# Altium project 课题设计步进电机.PrjPCB
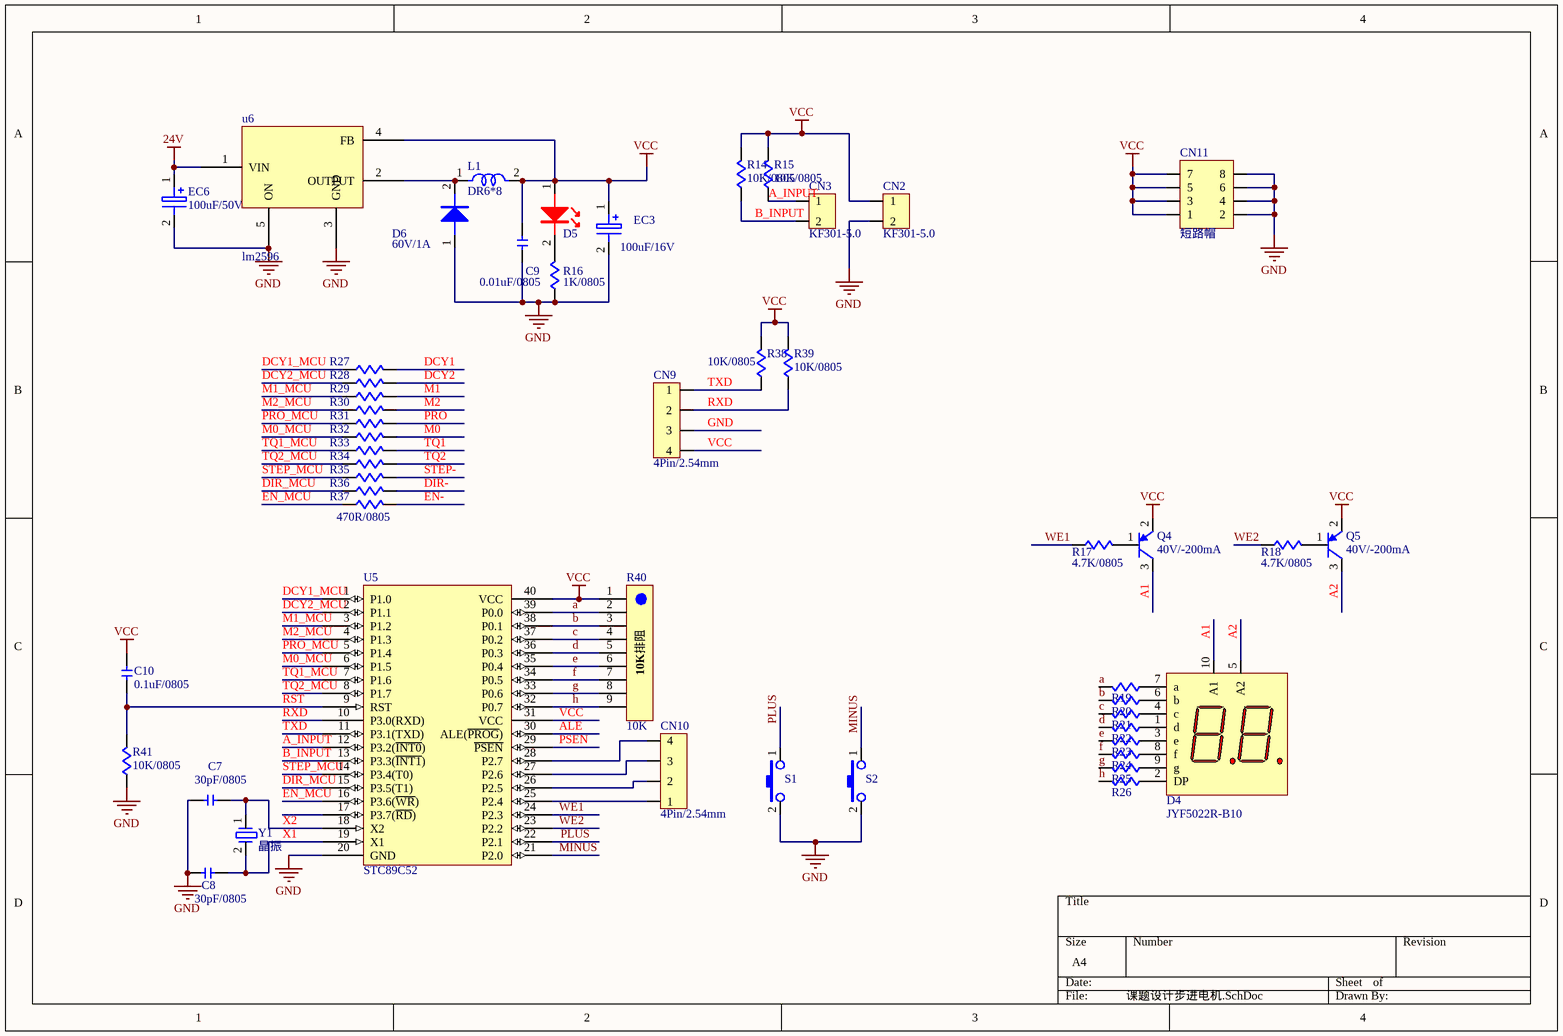
[diagram p0: 课题设计步进电机.SchDoc]
2 sheets, 84 parts. Net scope: global (net labels, ports and power ports of the same name join across sheets).
Board file: 电机驱动课程设计.PcbDoc
Sheets:
  课题设计步进电机.SchDoc
  电机驱动.SchDoc

## Sheet 课题设计步进电机.SchDoc
size A4

### Parts
C7  30pF/0805  [WSC0805]
C8  30pF/0805  [WSC0805]
C9  0.01uF/0805  [WSC0805]
C10  0.1uF/0805  [WSC0805]
CN2  KF301-5.0  [KF301-5.0]
CN3  KF301-5.0  [KF301-5.0]
CN9  4Pin/2.54mm  [THT-CON4-2.54-2.54A/S-H8.5]
CN10  4Pin/2.54mm  [THT-CON4-2.54-2.54A/S-H8.5]
CN11  短路帽  [THT-CON2*4-2.54-5.08A/D]
D4  JYF5022R-B10  [LED10-2.54*15.24-19A/S-AA]
D5  LED0805  [SD0805]  (value not drawn)
D6  60V/1A  [SDO-214AC(SMA)]
EC3  100uF/16V  [CAPC2-5-5*11A/D]
EC6  100uF/50V  [CAPC2-3.5-8*11.5A/S]
L1  DR6*8  [L2-3-8*11A/S]
Q4  40V/-200mA  [WSOT-23]
Q5  40V/-200mA  [WSOT-23]
R14  10K/0805  [WSR0805]
R15  10K/0805  [WSR0805]
R16  1K/0805  [WSR0805]
R17  4.7K/0805  [WSR0805]
R18  4.7K/0805  [WSR0805]
R19  470R/0805  [WSR0805]  (value not drawn)
R20  470R/0805  [WSR0805]  (value not drawn)
R21  470R/0805  [WSR0805]  (value not drawn)
R22  470R/0805  [WSR0805]  (value not drawn)
R23  470R/0805  [WSR0805]  (value not drawn)
R24  470R/0805  [WSR0805]  (value not drawn)
R25  470R/0805  [WSR0805]  (value not drawn)
R26  470R/0805  [WSR0805]  (value not drawn)
R27  470R/0805  [WSR0805]  (value not drawn)
R28  470R/0805  [WSR0805]  (value not drawn)
R29  470R/0805  [WSR0805]  (value not drawn)
R30  470R/0805  [WSR0805]  (value not drawn)
R31  470R/0805  [WSR0805]  (value not drawn)
R32  470R/0805  [WSR0805]
R33  470R/0805  [WSR0805]  (value not drawn)
R34  470R/0805  [WSR0805]  (value not drawn)
R35  470R/0805  [WSR0805]  (value not drawn)
R36  470R/0805  [WSR0805]  (value not drawn)
R37  470R/0805  [WSR0805]  (value not drawn)
R38  10K/0805  [WSR0805]
R39  10K/0805  [WSR0805]
R40  10K  [R_9*2.54]
R41  10K/0805  [WSR0805]
S1  12VDC/30mA  [THT-SW4-6.5*4.5A/D]  (value not drawn)
S2  12VDC/30mA  [THT-SW4-6.5*4.5A/D]  (value not drawn)
U5  STC89C52  [DIP-40]
u6  lm2596  [TO-220-5L]
Y1  晶振  [HC-49]

### Nets
24V: EC6.1 u6.1(VIN)
GND: C7.1 C8.1 C9.1 CN2.2 CN9.3 CN11.2 CN11.4 CN11.6 CN11.8 D6.1(A) EC3.2 EC6.2 R16.1 R41.1 S1.2 S2.2 U5.20(GND) u6.3(GND) u6.5(ON)
VCC: C9.2 C10.2 CN2.1 CN9.4 CN11.1 CN11.3 CN11.5 CN11.7 D5.1(A) EC3.1 L1.2 Q4.2(E) Q5.2(E) R14.2 R15.2 R38.2 R39.2 R40.1(COM) U5.31(VCC) U5.40(VCC) u6.4(FB)
a: R19.2 R40.2 U5.39(P0.0)
A1: D4.10(A1) Q4.3(C)
A2: D4.5(A2) Q5.3(C)
A_INPUT: CN3.1 R15.1 U5.12(P3.2(~{INT0}))
ALE: U5.30(ALE(~{PROG}))
b: R20.2 R40.3 U5.38(P0.1)
B_INPUT: CN3.2 R14.1 U5.13(P3.3(~{INT1}))
c: R21.2 R40.4 U5.37(P0.2)
d: R22.2 R40.5 U5.36(P0.3)
DCY1: R27.2
DCY1_MCU: R27.1 U5.1(P1.0)
DCY2: R28.2
DCY2_MCU: R28.1 U5.2(P1.1)
DIR-: R36.2
DIR_MCU: R36.1 U5.15(P3.5(T1))
e: R23.2 R40.6 U5.35(P0.4)
EN-: R37.2
EN_MCU: R37.1 U5.16(P3.6(~{WR}))
f: R24.2 R40.7 U5.34(P0.5)
g: R25.2 R40.8 U5.33(P0.6)
h: R26.2 R40.9 U5.32(P0.7)
M0: R32.2
M0_MCU: R32.1 U5.6(P1.5)
M1: R29.2
M1_MCU: R29.1 U5.3(P1.2)
M2: R30.2
M2_MCU: R30.1 U5.4(P1.3)
MINUS: S2.1 U5.21(P2.0)
PLUS: S1.1 U5.22(P2.1)
PRO: R31.2
PRO_MCU: R31.1 U5.5(P1.4)
PSEN: U5.29(~{PSEN})
RST: C10.1 R41.2 U5.9(RST)
RXD: CN9.2 R39.1 U5.10(P3.0(RXD))
STEP-: R35.2
STEP_MCU: R35.1 U5.14(P3.4(T0))
TQ1: R33.2
TQ1_MCU: R33.1 U5.7(P1.6)
TQ2: R34.2
TQ2_MCU: R34.1 U5.8(P1.7)
TXD: CN9.1 R38.1 U5.11(P3.1(TXD))
WE1: R17.1 U5.24(P2.3)
WE2: R18.1 U5.23(P2.2)
X1: C8.2 U5.19(X1) Y1.2
X2: C7.2 U5.18(X2) Y1.1
NetCN10_1: CN10.1 U5.25(P2.4)
NetCN10_2: CN10.2 U5.26(P2.5)
NetCN10_3: CN10.3 U5.27(P2.6)
NetCN10_4: CN10.4 U5.28(P2.7)
NetD4_1: D4.1(d) R22.1
NetD4_2: D4.2(DP) R26.1
NetD4_3: D4.3(e) R23.1
NetD4_4: D4.4(c) R21.1
NetD4_6: D4.6(b) R20.1
NetD4_7: D4.7(a) R19.1
NetD4_8: D4.8(f) R24.1
NetD4_9: D4.9(g) R25.1
NetD5_2: D5.2(K) R16.2
NetD6_2: D6.2(K) L1.1 u6.2(OUTPUT)
NetQ4_1: Q4.1(B) R17.2
NetQ5_1: Q5.1(B) R18.2

Not connected (* = marked no-connect by the designer): U5 17(P3.7(~{RD}))

### Notes on the sheet
- (in symbol 插件排阻) 10K排阻

### Library data of the parts
C7 C8 = R21080010: R21080010/工业C/消费C/贴片电容/30pF±5%/50V/NPO/0805; 装配类型: SMD; 物料编码: R21080010; 物料描述: 贴片电容/30pF±5%/50V/NPO/0805; 优选等级: 工业C/消费C
C9 = R21050097: R21050097/工业C/消费C/贴片电容/0.01uF±5%/50V/NPO/0805; 装配类型: SMD; 物料编码: R21050097; 物料描述: 贴片电容/0.01uF±5%/50V/NPO/0805; 优选等级: 工业C/消费C
C10 = R21050005: R21050005/工业B/消费B/贴片电容/0.1uF±10%/50V/X7R/0805; 装配类型: SMD; 物料编码: R21050005; 物料描述: 贴片电容/0.1uF±10%/50V/X7R/0805; 优选等级: 工业B/消费B
CN9 CN10 = R30041122: R30041122/消费B/普通插座/单排排母/4PIN/3A/单排/直脚/鱼叉母座/2.54mm/-40~105℃/H=8.5mm; 优选等级: 消费B; 装配类型: THT; 物料描述: 普通插座/单排排母/4PIN/3A/单排/直脚/鱼叉母座/2.54mm/-40~105℃/H=8.5mm; 物料编码: R30041122
CN11 = 2*54Pin/2.54mm
D4 = R26010188: R26010188/消费C/数码管/2位/共阳/红色630nm/40mcd/25*19*8mm/无铅; 优选等级: 消费C; 装配类型: THT; 物料描述: 数码管/2位/共阳/红色630nm/40mcd/25*19*8mm/无铅; 物料编码: R26010188
D5 = R26010108: R26010108/工业A/消费A/发光二极管/红色/61mcd@20mA/0805SMD/LED0805; 装配类型: SMD; 物料描述: 发光二极管/红色/61mcd@20mA/0805SMD; 物料编码: R26010108; 优选等级: 工业A/消费A
D6 = R26030097: R26030097/工业C/肖特基二极管/60V/1A/0.70V/SMA/B160; 优选等级: 工业C; 装配类型: SMD; 物料描述: 肖特基二极管/60V/1A/0.70V/SMA; 物料编码: R26030097
EC3 = R21010764: R21010764/消费C/铝电解电容/105℃/100uF/16V/φ5*11; 优选等级: 消费C; 装配类型: THT; 物料编码: R21010764; 物料描述: 铝电解电容/105℃/100uF/16V/φ5*11
EC6 = R21010695: R21010695/消费C/电解电容/105℃/100uF/50v/φ8*11.5/引脚间距3.5mm; 优选等级: 消费C; 装配类型: THT; 物料编码: R21010695; 物料描述: 电解电容/105℃/100uF/50v/φ8*11.5/引脚间距3.5mm
L1 = R22011019: R22011019/消费A/工字型电感DR6*8/100uH/MC1600-L3; 优选等级: 消费A; 装配类型: THT; 物料编码: R22011019; 物料描述: 工字型电感DR6*8/100uH/MC1600-L3
Q4 Q5 = R26080002: R26080002/工业A/消费A/小信号三极管/PNP/-40V/-200mA/SOT-23; 装配类型: SMD; 物料编码: R26080002; 物料描述: 小信号三极管/PNP/-40V/-200mA/SOT-23; 优选等级: 工业A/消费A
R14 R15 R38 R39 R41 = R20180048: R20180048/工业A/消费A/贴片电阻/1/8W/10KΩ±5%/0805; 装配类型: SMD; 物料编码: R20180048; 物料描述: 贴片电阻/1/8W/10KΩ±5%/0805; 优选等级: 工业A/消费A
R16 = R20180023: R20180023/工业A/消费A/贴片电阻/1/8W/1KΩ±5%/0805; 装配类型: SMD; 物料编码: R20180023; 物料描述: 贴片电阻/1/8W/1KΩ±5%/0805; 优选等级: 工业A/消费A
R17 R18 = R20180039: R20180039/工业A/消费A/贴片电阻/1/8W/4.7KΩ±5%/0805; 装配类型: SMD; 物料编码: R20180039; 物料描述: 贴片电阻/1/8W/4.7KΩ±5%/0805; 优选等级: 工业A/消费A
R19-R26 = R20180017: R20180017/工业A/消费A/贴片电阻/1/8W/470Ω±5%/0805; 装配类型: SMD; 物料编码: R20180017; 物料描述: 贴片电阻/1/8W/470Ω±5%/0805; 优选等级: 工业A/消费A
R27-R37 = R20180245: R20180245/工业C/消费C/贴片电阻/1/8W/470Ω±1%/0805/ROHS; 装配类型: SMD; 物料编码: R20180245; 物料描述: 贴片电阻/1/8W/470Ω±1%/0805/ROHS; 优选等级: 工业C/消费C
R40 = 插件排阻
S1 S2 = R34010007: R34010007/消费A/微动开关/12VDC/30mA/6*6*4.3mm/插件; 优选等级: 消费A; 装配类型: THT; 物料编码: R34010007; 物料描述: 微动开关/12VDC/30mA/6*6*4.3mm/插件
U5 = AT89C51

## Sheet 电机驱动.SchDoc
size A4
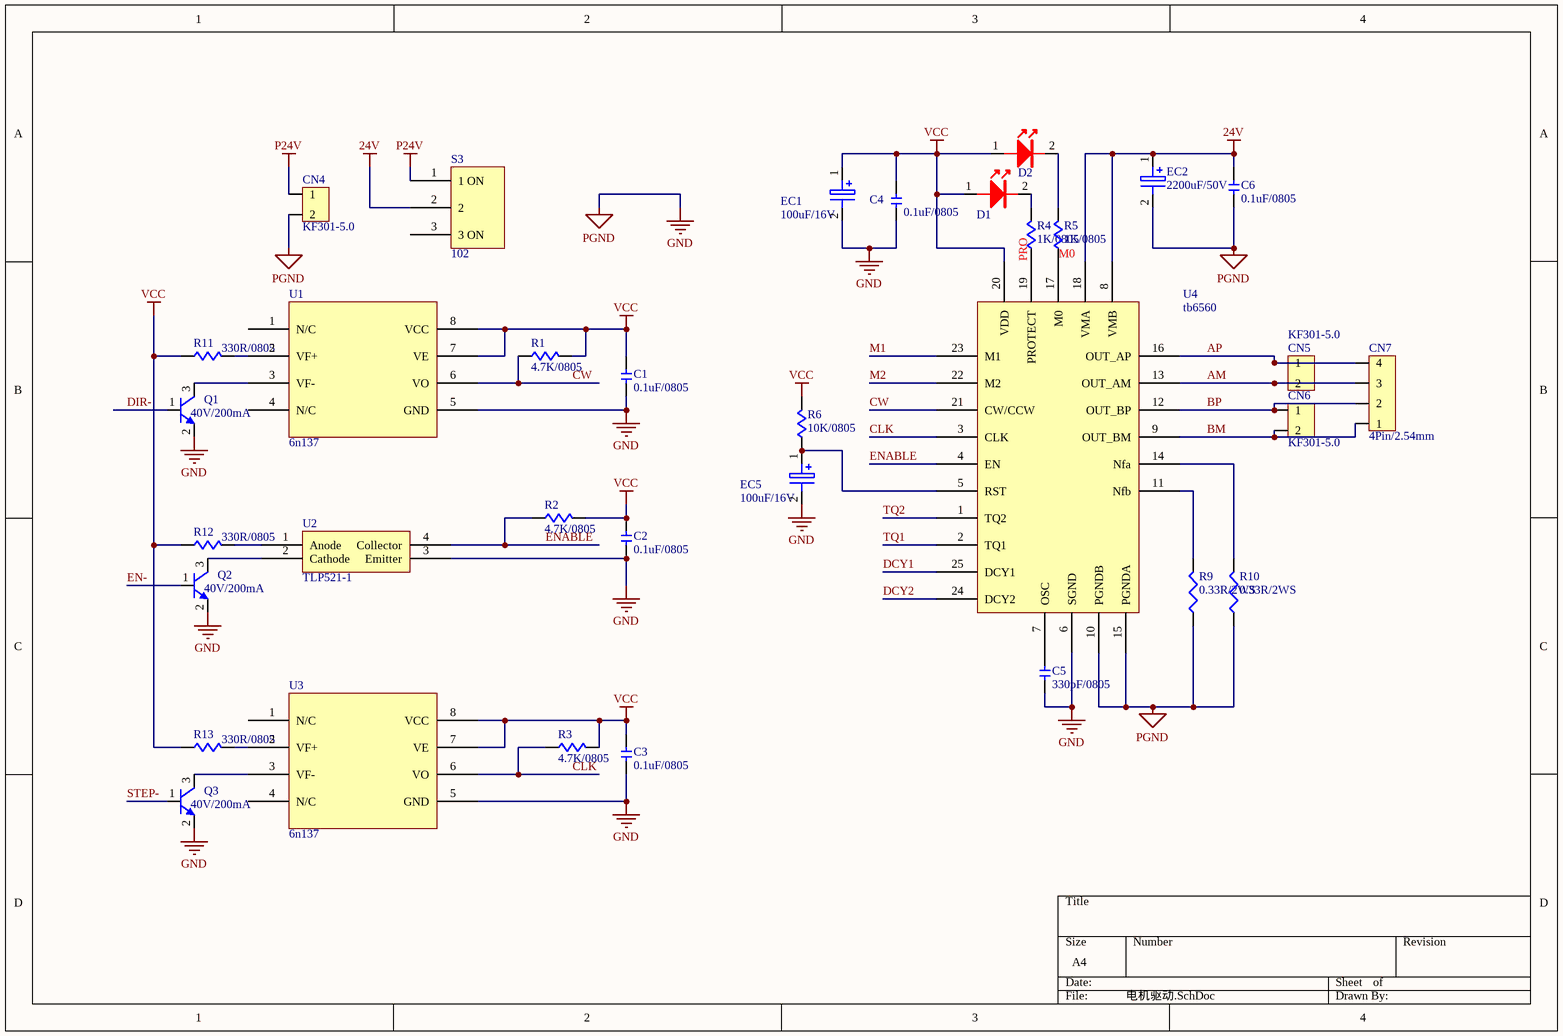
[diagram p1: 电机驱动.SchDoc]

### Parts
C1  0.1uF/0805  [WSC0805]
C2  0.1uF/0805  [WSC0805]
C3  0.1uF/0805  [WSC0805]
C4  0.1uF/0805  [WSC0805]
C5  330pF/0805  [WSC0805]
C6  0.1uF/0805  [WSC0805]
CN4  KF301-5.0  [KF301-5.0]
CN5  KF301-5.0  [KF301-5.0]
CN6  KF301-5.0  [KF301-5.0]
CN7  4Pin/2.54mm  [THT-CON4-2.54-2.54A/S-H8.5]
D1  LED0805  [SD0805]  (value not drawn)
D2  LED0805  [SD0805]  (value not drawn)
EC1  100uF/16V  [CAPC2-5-5*11A/D]
EC2  2200uF/50V  [CAPC2-7.5-18*35.5A/S]
EC5  100uF/16V  [CAPC2-5-5*11A/D]
Q1  40V/200mA  [WSOT-23]
Q2  40V/200mA  [WSOT-23]
Q3  40V/200mA  [WSOT-23]
R1  4.7K/0805  [WSR0805]
R2  4.7K/0805  [WSR0805]
R3  4.7K/0805  [WSR0805]
R4  1K/0805  [WSR0805]
R5  1K/0805  [WSR0805]
R6  10K/0805  [WSR0805]
R9  0.33R/2WS  [R2-7.5-4.5A/S]
R10  0.33R/2WS  [R2-7.5-4.5A/S]
R11  330R/0805  [WSR0805]
R12  330R/0805  [WSR0805]
R13  330R/0805  [WSR0805]
S3  102  [开关]
U1  6n137  [6N137]
U2  TLP521-1  [tlp521 - duplicate]
U3  6n137  [6N137]
U4  tb6560  [TB6560]

### Nets
24V: C6.2 EC2.1 S3.2 U4.8(VMB) U4.18(VMA)
GND: C1.1 C2.1 C3.1 C4.1 C5.1 C6.1 CN4.2 EC1.2 EC2.2 EC5.2 Q1.2(E) Q2.2(E) Q3.2(E) R9.1 R10.1 U1.5(GND) U2.3(Emitter) U3.5(GND) U4.6(SGND) U4.10(PGNDB) U4.15(PGNDA)  [also labelled PGND]
P24V: CN4.1 S3.1(1_ON)
VCC: C1.2 C2.2 C3.2 C4.2 D1.1(A) D2.1(A) EC1.1 R1.2 R2.2 R3.2 R6.2 R11.1 R12.1 R13.1 U1.7(VE) U1.8(VCC) U3.7(VE) U3.8(VCC) U4.20(VDD)
AM: CN5.2 CN7.3 U4.13(OUT_AM)
AP: CN5.1 CN7.4 U4.16(OUT_AP)
BM: CN6.2 CN7.1 U4.9(OUT_BM)
BP: CN6.1 CN7.2 U4.12(OUT_BP)
CLK: R3.1 U3.6(VO) U4.3(CLK)
CW: R1.1 U1.6(VO) U4.21(CW/CCW)
DCY1: U4.25(DCY1)
DCY2: U4.24(DCY2)
DIR-: Q1.1(B)
EN-: Q2.1(B)
ENABLE: R2.1 U2.4(Collector) U4.4(EN)
M0: R5.1 U4.17(M0)
M1: U4.23(M1)
M2: U4.22(M2)
PRO: R4.1 U4.19(PROTECT)
STEP-: Q3.1(B)
TQ1: U4.2(TQ1)
TQ2: U4.1(TQ2)
NetC5_2: C5.2 U4.7(OSC)
NetD1_2: D1.2(K) R4.2
NetD2_2: D2.2(K) R5.2
NetEC5_1: EC5.1 R6.1 U4.5(RST)
NetQ1_3: Q1.3(C) U1.3(VF-)
NetQ2_3: Q2.3(C) U2.2(Cathode)
NetQ3_3: Q3.3(C) U3.3(VF-)
NetR9_2: R9.2 U4.11(Nfb)
NetR10_2: R10.2 U4.14(Nfa)
NetR11_2: R11.2 U1.2(VF+)
NetR12_2: R12.2 U2.1(Anode)
NetR13_2: R13.2 U3.2(VF+)

Not connected (* = marked no-connect by the designer): S3 3(3_ON); U1 1(N/C) 4(N/C); U3 1(N/C) 4(N/C)

### Library data of the parts
C1-C4 = R21050165: R21050165/工业C/消费C/贴片电容/0.1uF/±10%/50V/X7R/0805; 装配类型: SMD; 物料编码: R21050165; 物料描述: 贴片电容/0.1uF/±10%/50V/X7R/0805; 优选等级: 工业C/消费C
C5 = R21180028: R21180028/消费C/台系贴片电容/330pF/±10%/50V/X7R/0805; 优选等级: 消费C; 装配类型: SMD; 物料编码: R21180028; 物料描述: 台系贴片电容/330pF/±10%/50V/X7R/0805
C6 = R21050005: as C10 on sheet 课题设计步进电机; 物料编码: R21050005; 物料描述: 贴片电容/0.1uF±10%/50V/X7R/0805; 优选等级: 工业B/消费B
CN7 = R30041122: as CN9 on sheet 课题设计步进电机; 物料描述: 普通插座/单排排母/4PIN/3A/单排/直脚/鱼叉母座/2.54mm/-40~105℃/H=8.5mm; 物料编码: R30041122
D1 D2 = R26010108: as D5 on sheet 课题设计步进电机; 物料描述: 发光二极管/红色/61mcd@20mA/0805SMD; 物料编码: R26010108; 优选等级: 工业A/消费A
EC1 EC5 = R21010764: as EC3 on sheet 课题设计步进电机; 物料编码: R21010764; 物料描述: 铝电解电容/105℃/100uF/16V/φ5*11
EC2 = R21110099: R21110099/工业B/铝电解电容/105℃/2200uF/50V/低阻/φ18*35.5/7000h; 优选等级: 工业B; 装配类型: THT; 物料编码: R21110099; 物料描述: 铝电解电容/105℃/2200uF/50V/低阻/φ18*35.5/7000h
Q1-Q3 = R26080001: R26080001/工业A/消费A/小信号三极管/NPN/40V/200mA/SOT-23; 装配类型: SMD; 物料编码: R26080001; 物料描述: 小信号三极管/NPN/40V/200mA/SOT-23; 优选等级: 工业A/消费A
R1-R3 = R20180039: as R17 on sheet 课题设计步进电机; 物料编码: R20180039; 物料描述: 贴片电阻/1/8W/4.7KΩ±5%/0805; 优选等级: 工业A/消费A
R4 R5 = R20180023: as R16 on sheet 课题设计步进电机; 物料编码: R20180023; 物料描述: 贴片电阻/1/8W/1KΩ±5%/0805; 优选等级: 工业A/消费A
R6 = R20180048: as R14 on sheet 课题设计步进电机; 物料编码: R20180048; 物料描述: 贴片电阻/1/8W/10KΩ±5%/0805; 优选等级: 工业A/消费A
R9 R10 = R20040079: R20040079/工业B/消费B/无感线绕电阻/2WS/0.33Ω±5%/小型4.5*11; 装配类型: THT; 优选等级: 工业B/消费B; 物料描述: 无感线绕电阻/2WS/0.33Ω±5%/小型4.5*11; 物料编码: R20040079
R11-R13 = R20180090: R20180090/工业A/消费A/贴片电阻/1/8W/330Ω±5%/0805; 装配类型: SMD; 物料编码: R20180090; 物料描述: 贴片电阻/1/8W/330Ω±5%/0805; 优选等级: 工业A/消费A
S3 = switch mts102
U1 U3 = 6n137: 6n137高速度光耦
U2 = TLP521: TLP521-1/光耦
U4 = tb6560: tb6560、步进电机驱动

## Nets that join several sheets
24V: 课题设计步进电机 (EC6.1 u6.1), 电机驱动 (5 pins)
GND: 课题设计步进电机 (19 pins), 电机驱动 (21 pins)
VCC: 课题设计步进电机 (21 pins), 电机驱动 (19 pins)
DCY1: 课题设计步进电机 (R27.2), 电机驱动 (U4.25)
DCY2: 课题设计步进电机 (R28.2), 电机驱动 (U4.24)
DIR-: 课题设计步进电机 (R36.2), 电机驱动 (Q1.1)
EN-: 课题设计步进电机 (R37.2), 电机驱动 (Q2.1)
M0: 课题设计步进电机 (R32.2), 电机驱动 (R5.1 U4.17)
M1: 课题设计步进电机 (R29.2), 电机驱动 (U4.23)
M2: 课题设计步进电机 (R30.2), 电机驱动 (U4.22)
PRO: 课题设计步进电机 (R31.2), 电机驱动 (R4.1 U4.19)
STEP-: 课题设计步进电机 (R35.2), 电机驱动 (Q3.1)
TQ1: 课题设计步进电机 (R33.2), 电机驱动 (U4.2)
TQ2: 课题设计步进电机 (R34.2), 电机驱动 (U4.1)